# EAGLE schematic LIDAR_BreakoutV2 (EAGLE 9.2.0)
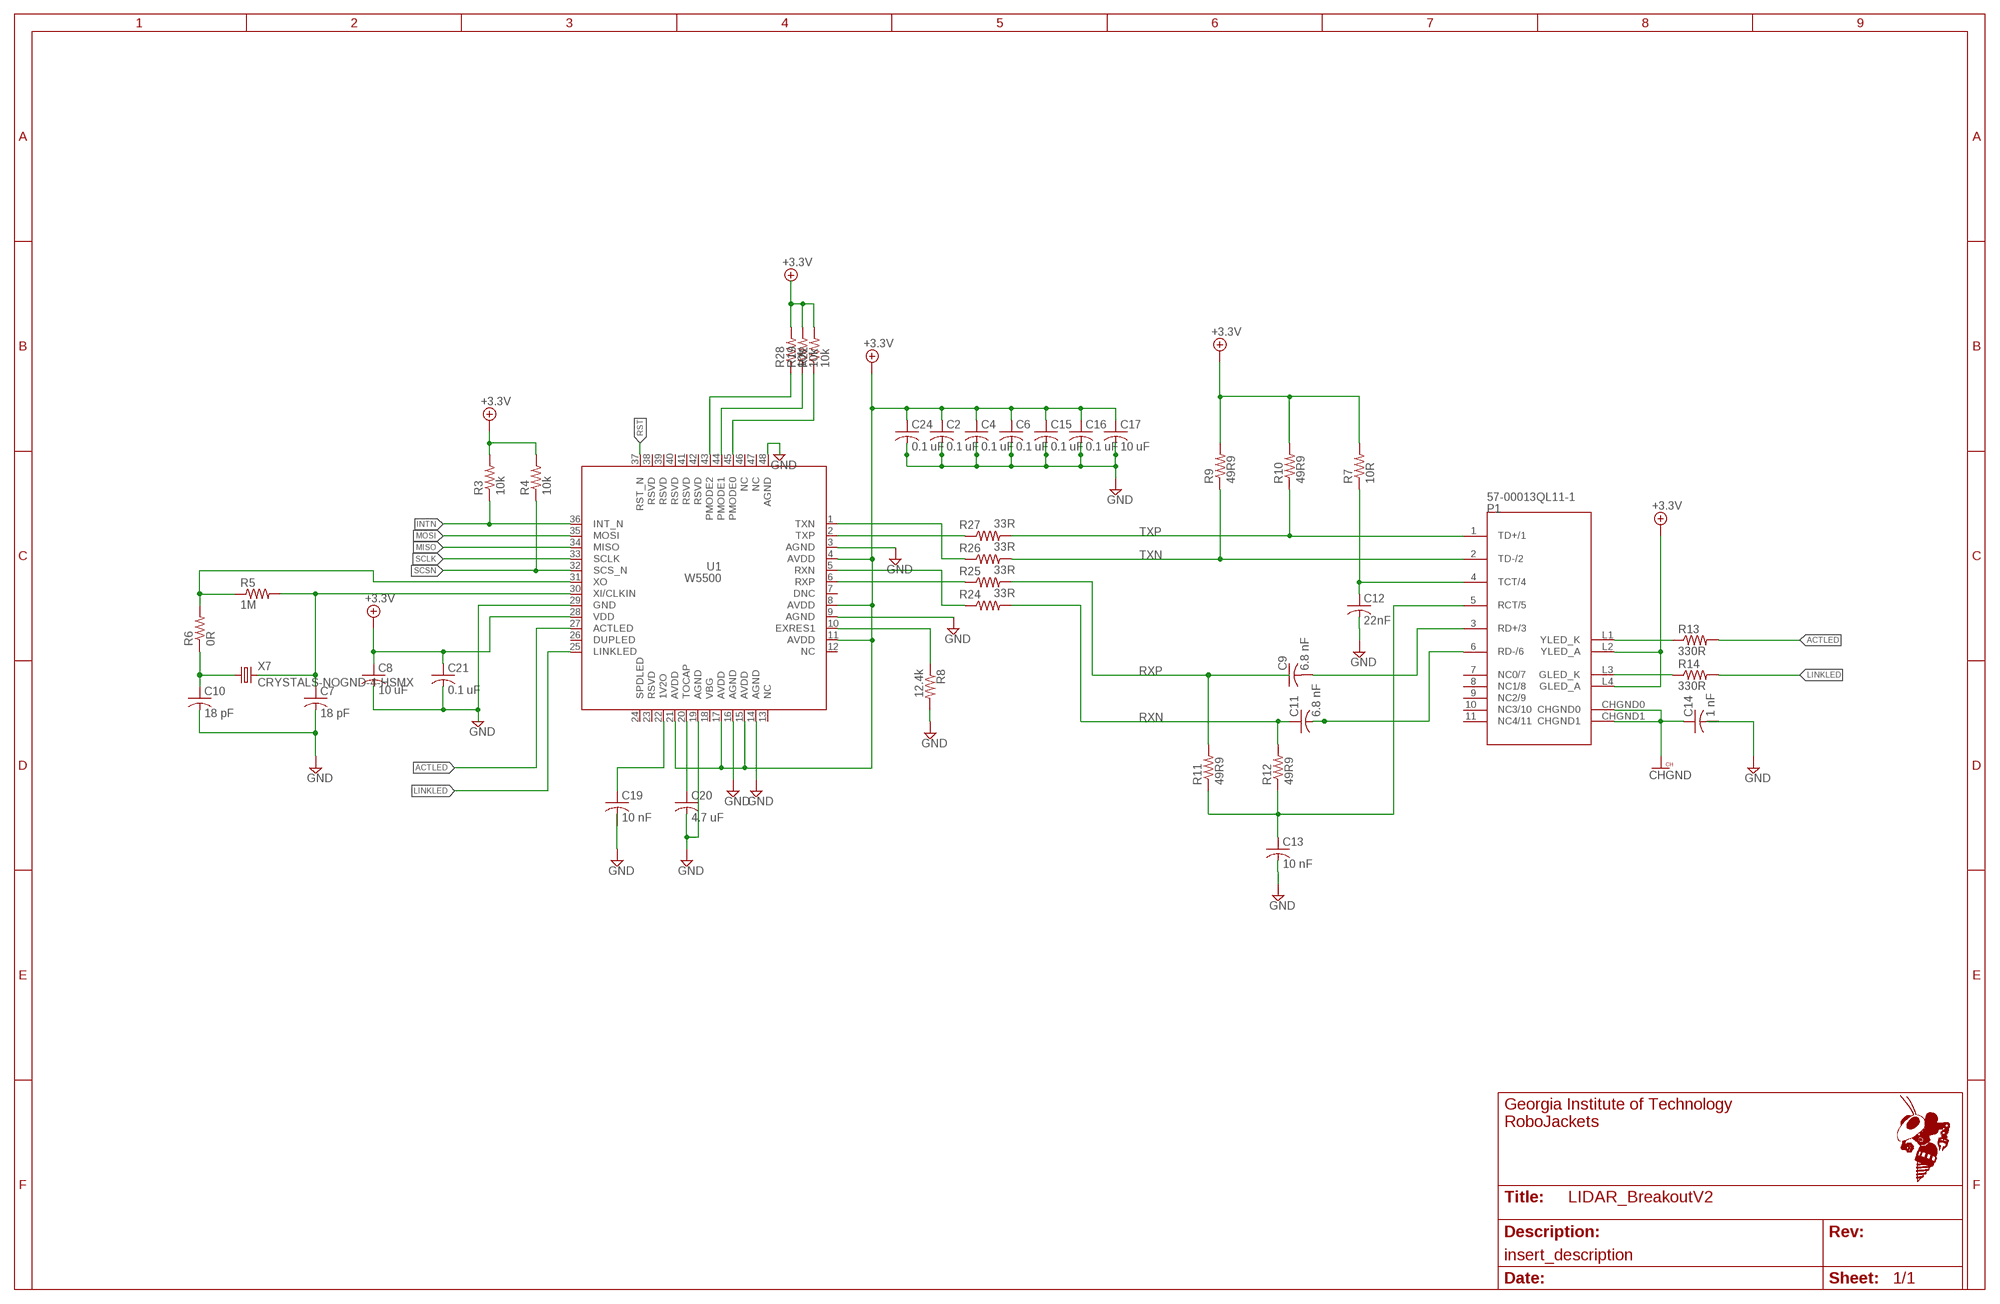
[diagram p0: schematic, sheet 1, part 1 of 2]
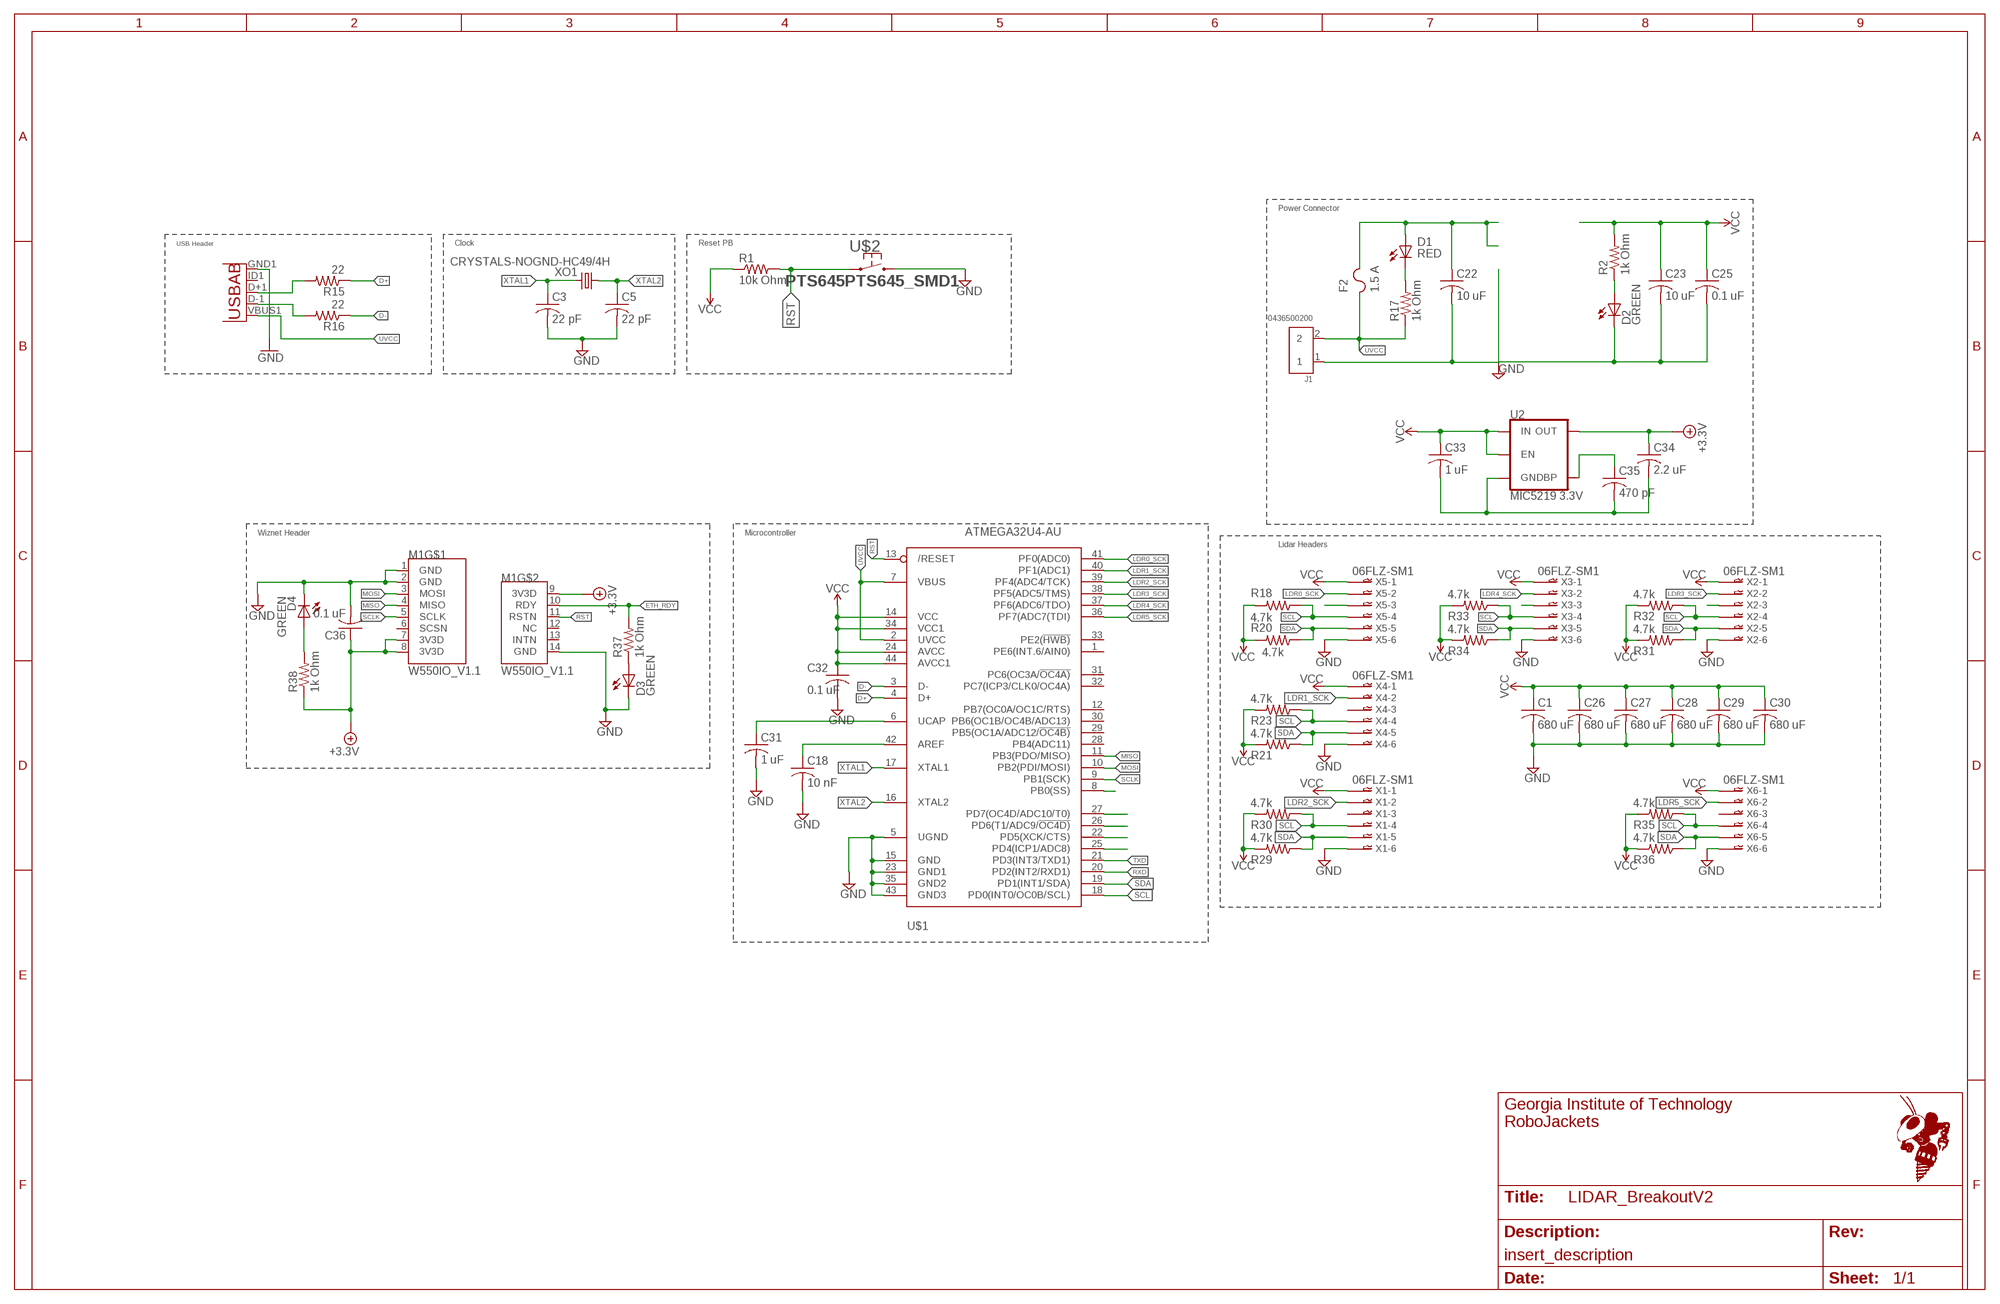
[diagram p1: schematic, sheet 1, part 2 of 2]
FRAME1 (FRAME_B_L): SCH_DESC: insert_description
FRAME2 (FRAME_B_L): SCH_DESC: insert_description

## Parts
C1  680 uF  C-USC3216  [C3216]
C2  0.1 uF  C-USC1608  [C1608]
C3  22 pF  C-USC0603  [C0603]
C4  0.1 uF  C-USC1608  [C1608]
C5  22 pF  C-USC0603  [C0603]
C6  0.1 uF  C-USC1608  [C1608]
C7  18 pF  C-USC1608  [C1608]
C8  10 uF  C-USC3216  [C3216]
C9  6.8 nF  C-USC1608  [C1608]
C10  18 pF  C-USC1608  [C1608]
C11  6.8 nF  C-USC1608  [C1608]
C12  22nF  C-USC1608  [C1608]
C13  10 nF  C-USC1608  [C1608]
C14  1 nF  C-USC1808  [C1808]
C15  0.1 uF  C-USC1608  [C1608]
C16  0.1 uF  C-USC1608  [C1608]
C17  10 uF  C-USC3216  [C3216]
C18  10 nF  C-USC0603  [C0603]
C19  10 nF  C-USC0603  [C0603]
C20  4.7 uF  C-USC0603  [C0603]
C21  0.1 uF  C-USC1608  [C1608]
C22  10 uF  C-USC3216  [C3216]
C23  10 uF  C-USC3216  [C3216]
C24  0.1 uF  C-USC1608  [C1608]
C25  0.1 uF  C-USC0603  [C0603]
C26  680 uF  C-USC3216  [C3216]
C27  680 uF  C-USC3216  [C3216]
C28  680 uF  C-USC3216  [C3216]
C29  680 uF  C-USC3216  [C3216]
C30  680 uF  C-USC3216  [C3216]
C31  1 uF  C-USC0603  [C0603]
C32  0.1 uF  C-USC0603  [C0603]
C33  1 uF  C-USC0603  [C0603]
C34  2.2 uF  C-USC0603  [C0603]
C35  470 pF  C-USC0603  [C0603]
C36  0.1 uF  C-USC0603  [C0603]
D1  RED  LED-SMD-RED  [CHIP-LED0603]
D2  GREEN  LEDCHIP-LED0603  [CHIP-LED0603]
D3  GREEN  LEDCHIP-LED0603  [CHIP-LED0603]
D4  GREEN  LEDCHIP-LED0603  [CHIP-LED0603]
F2  1.5 A  CHIP_FUSE0603  [F0603]
J1  0436500200  [MOLEX_0436500200]
M1  W550IO_V1.1  [WIZ550IO_V1.1]
P1  57-00013QL11-1  [57-00013QL11-1]
R1  10k Ohm  R-US_R0603  [R0603]
R2  1k Ohm  R-US_R0603  [R0603]
R3  10k  R-US_R0603  [R0603]
R4  10k  R-US_R0603  [R0603]
R5  1M  R-US_R0603  [R0603]
R6  0R  R-US_R0603  [R0603]
R7  10R  R-US_R0603  [R0603]
R8  12.4k  R-US_R0603  [R0603]
R9  49R9  R-US_R0603  [R0603]
R10  49R9  R-US_R0603  [R0603]
R11  49R9  R-US_R0603  [R0603]
R12  49R9  R-US_R0603  [R0603]
R13  330R  R-US_R0603  [R0603]
R14  330R  R-US_R0603  [R0603]
R15  22  RESISTOR0603-RES  [0603-RES]
R16  22  RESISTOR0603-RES  [0603-RES]
R17  1k Ohm  R-US_R0603  [R0603]
R18  4.7k  R-US_R0603  [R0603]
R19  10k  R-US_R0603  [R0603]
R20  4.7k  R-US_R0603  [R0603]
R21  4.7k  R-US_R0603  [R0603]
R22  10k  R-US_R0603  [R0603]
R23  4.7k  R-US_R0603  [R0603]
R24  33R  R-US_R0603  [R0603]
R25  33R  R-US_R0603  [R0603]
R26  33R  R-US_R0603  [R0603]
R27  33R  R-US_R0603  [R0603]
R28  10k  R-US_R0603  [R0603]
R29  4.7k  R-US_R0603  [R0603]
R30  4.7k  R-US_R0603  [R0603]
R31  4.7k  R-US_R0603  [R0603]
R32  4.7k  R-US_R0603  [R0603]
R33  4.7k  R-US_R0603  [R0603]
R34  4.7k  R-US_R0603  [R0603]
R35  4.7k  R-US_R0603  [R0603]
R36  4.7k  R-US_R0603  [R0603]
R37  1k Ohm  R-US_R0603  [R0603]
R38  1k Ohm  R-US_R0603  [R0603]
U1  W5500  [W5500]
U2  MIC5219 3.3V  V_REG_MIC52193.3V  [SOT23-5]
U$1  ATMEGA32U4-AU  [TQFP44]
U$2  PTS645PTS645_SMD1  [PTS645_SMD]
X1  06FLZ-SM1  [6FLZ-SM]
X2  06FLZ-SM1  [6FLZ-SM]
X3  06FLZ-SM1  [6FLZ-SM]
X4  06FLZ-SM1  [6FLZ-SM]
X5  06FLZ-SM1  [6FLZ-SM]
X6  06FLZ-SM1  [6FLZ-SM]
X7  CRYSTALS-NOGND-4-HSMX  [HC49-4-HSMX]
X8  USB-ABIN&OUT  [USB-AB-MICRO-SMD-V03-IN&OUT]
XO1  CRYSTALS-NOGND-HC49/4H  [HC49]

## Nets
+3.3V: C2.1 C4.1 C6.1 C8.1 C15.1 C16.1 C17.1 C21.1 C24.1 C34.1 C36.1 M1.7(3V3D) M1.8(3V3D) M1.9(3V3D) P1.L2(YLED_A) P1.L4(GLED_A) R3.2 R4.2 R7.2 R9.2 R10.2 R19.2 R22.2 R28.2 R38.1 U1.4(AVDD) U1.8(AVDD) U1.11(AVDD) U1.15(AVDD) U1.17(AVDD) U1.21(AVDD) U1.28(VDD) U2.5(OUT)
ACTLED: R13.2 U1.27(ACTLED)
CHGND: C14.1 P1.CHGND0 P1.CHGND1
D+: R15.1 U$1.4(D+)
D-: R16.1 U$1.3(D-)
ETH_RDY: M1.10(RDY) R37.2
GND: C1.2 C2.2 C3.2 C4.2 C5.2 C6.2 C7.2 C8.2 C10.2 C12.2 C13.2 C14.2 C15.2 C16.2 C17.2 C18.2 C19.2 C20.2 C21.2 C22.2 C23.2 C24.2 C25.2 C26.2 C27.2 C28.2 C29.2 C30.2 C31.2 C32.2 C36.2 D2.C D3.C D4.C J1.1 M1.1(GND) M1.2(GND) M1.14(GND) R8.2 U1.3(AGND) U1.9(AGND) U1.14(AGND) U1.16(AGND) U1.19(AGND) U1.29(GND) U1.48(AGND) U$1.5(UGND) U$1.15(GND) U$1.23(GND1) U$1.35(GND2) U$1.43(GND3) U$2.P$3 U$2.P$4 X1.6 X2.6 X3.6 X4.6 X5.6 X6.6 X8.GND1(GND)
INTN: R3.1 U1.36(INT_N)
LDR0_SCK: U$1.41(PF0(ADC0)) X5.2
LDR1_SCK: U$1.40(PF1(ADC1)) X4.2
LDR2_SCK: U$1.39(PF4(ADC4/TCK)) X1.2
LDR3_SCK: U$1.38(PF5(ADC5/TMS)) X2.2
LDR4_SCK: U$1.37(PF6(ADC6/TDO)) X3.2
LDR5_SCK: U$1.36(PF7(ADC7(TDI)) X6.2
LEFT_B: U$1.27(PD7(OC4D/ADC10/T0))
LIFT_A: U$1.26(PD6(T1/ADC9/!OC4D))
LINKLED: R14.2 U1.25(LINKLED)
MISO: M1.4(MISO) U1.34(MISO) U$1.11(PB3(PDO/MISO)) U$1.25(PD4(ICP1/ADC8))
MOSI: M1.3(MOSI) U1.35(MOSI) U$1.10(PB2(PDI/MOSI)) U$1.22(PD5(XCK/CTS)) X5.3
N$1: C10.1 R6.1 X7.1
N$2: C22.1 D1.A F2.2
N$3: D2.A R2.1
N$4: R28.1 U1.43(PMODE2)
N$6: D1.C(K) R17.2
N$7: C18.1 U$1.42(AREF)
N$8: X2.3
N$9: C31.1 U$1.6(UCAP)
N$10: R19.1 U1.44(PMODE1)
N$11: R22.1 U1.45(PMODE0)
N$12: X3.3
N$13: C20.1 U1.20(TOCAP)
N$14: R16.2 X8.D-1(D-)
N$15: C19.1 U1.22(1V2O)
N$16: C9.2 P1.3(RD+/3)
N$17: R8.1 U1.10(EXRES1)
N$18: C11.2 P1.6(RD-/6)
N$19: C13.1 P1.5(RCT/5) R11.1 R12.1
N$20: R25.1 U1.6(RXP)
N$21: C12.1 P1.4(TCT/4) R7.1
N$22: R5.1 R6.2 U1.31(XO)
N$23: R15.2 X8.D+1(D+)
N$24: P1.L3(GLED_K) R14.1
N$25: P1.L1(YLED_K) R13.1
N$26: R24.1 U1.5(RXN)
N$27: R27.1 U1.2(TXP)
N$28: R26.1 U1.1(TXN)
N$29: C7.1 R5.2 U1.30(XI/CLKIN) X7.2
N$30: D3.A R37.1
N$31: C35.1 U2.4(BP)
N$32: C33.2 C34.2 C35.2 U2.2(GND)
N$34: D4.A R38.2
RST: M1.11(RSTN) R1.2 U1.37(RST_N) U$1.13(/RESET) U$2.P$1 U$2.P$2
RXD: U$1.20(PD2(INT2/RXD1))
RXN: C11.1 R12.2 R24.2
RXP: C9.1 R11.2 R25.2
SCL: R18.1 R23.1 R30.1 R32.1 R33.1 R35.1 U$1.18(PD0(INT0/OC0B/SCL)) X1.4 X2.4 X3.4 X4.4 X5.4 X6.4
SCLK: M1.5(SCLK) U1.33(SCLK) U$1.9(PB1(SCK))
SCSN: R4.1 U1.32(SCS_N) U$1.8(PB0(SS))
SDA: R20.1 R21.1 R29.1 R31.1 R34.1 R36.1 U$1.19(PD1(INT1/SDA)) X1.5 X2.5 X3.5 X4.5 X5.5 X6.5
TXD: U$1.21(PD3(INT3/TXD1))
TXN: P1.2(TD-/2) R9.1 R26.2
TXP: P1.1(TD+/1) R10.1 R27.2
UVCC: F2.1 J1.2 R17.1 U$1.2(UVCC) U$1.7(VBUS) X8.VBUS1(VBUS)
VCC: C1.1 C23.1 C25.1 C26.1 C27.1 C28.1 C29.1 C30.1 C32.1 C33.1 R1.1 R2.2 R18.2 R20.2 R21.2 R23.2 R29.2 R30.2 R31.2 R32.2 R33.2 R34.2 R35.2 R36.2 U2.1(IN) U2.3(EN) U$1.14(VCC) U$1.24(AVCC) U$1.34(VCC1) U$1.44(AVCC1) X1.1 X2.1 X3.1 X4.1 X5.1 X6.1
XTAL1: C3.1 U$1.17(XTAL1) XO1.2
XTAL2: C5.1 U$1.16(XTAL2) XO1.1
Unconnected: M1.6(SCSN) M1.12(NC) M1.13(INTN) P1.7(NC0/7) P1.8(NC1/8) P1.9(NC2/9) P1.10(NC3/10) P1.11(NC4/11) U1.7(DNC) U1.12(NC) U1.13(NC) U1.18(VBG) U1.23(RSVD) U1.24(SPDLED) U1.26(DUPLED) U1.38(RSVD) U1.39(RSVD) U1.40(RSVD) U1.41(RSVD) U1.42(RSVD) U1.46(NC) U1.47(NC) U$1.1(PE6(INT.6/AIN0)) U$1.12(PB7(OC0A/OC1C/RTS)) U$1.28(PB4(ADC11)) U$1.29(PB5(OC1A/ADC12/!OC4B)) U$1.30(PB6(OC1B/OC4B/ADC13)) U$1.31(PC6(OC3A/!OC4A)) U$1.32(PC7(ICP3/CLK0/OC4A)) U$1.33(PE2(!HWB)) X1.3 X4.3 X6.3 X8.ID1(USBID)

## Notes on the sheet
- Power Connector
- USB Header | Clock | Reset PB
- Wiznet Header | Microcontroller
- Lidar Headers

## Library data of the parts
C1 C2 C4 C6-C17 C21-C24 C26-C30 = rcl:C-US: CAPACITOR, American symbol; SPICEPREFIX: C
C3 C5 C18-C20 C25 C31-C36 = resistor:C-US: CAPACITOR, American symbol
D1 = RoboJackets-LEDs:LED-SMD; DIGIKEY: 160-1447-1-ND; MPN: LTST-C191KRKT
D2-D4 = led:LED: LED OSRAM: - CHIPLED LG R971, LG N971, LY N971, LG Q971, LY Q971, LO R971, LY R971 LH N974, LH R974 LS Q976, LO Q976, LY Q976 LO Q996 - Hyper CHIPLED LW Q18S LB Q993, LB Q99A, LB R99A - SideLED LS A670, LO A670, LY A670, LG A670, LP A670 LB A673, LV A673, LT A673, LW A673 LH A674 LY A675 LS A676, LA A676, LO A676, LY A676, LW A676 LS A679, LY A679, LG A679 - Hyper Micro SIDELED® LS Y876, LA Y876, LO Y876, LY Y876 LT Y87S - SmartLED LW L88C, LW L88S LB L89C, LB L89S, LG L890 LS L89K, LO L89K, LY L89K LS L896, LA L896, LO L896, LY L896 - TOPLED LS T670, LO T670, LY T670, LG T670, LP T670 LSG T670, LSP T670, LSY T670, LOP T670, LYG T670 LG T671, LOG T671, LSG T671 LB T673, LV T673, LT T673, LW T673 LH T674 LS T676, LA T676, LO T676, LY T676, LB T676, LH T676, LSB T676, LW T676 LB T67C, LV T67C, LT T67C, LS T67K, LO T67K, LY T67K, LW E67C LS E67B, LA E67B, LO E67B, LY E67B, LB E67C, LV E67C, LT E67C LW T67C LS T679, LY T679, LG T679 LS T770, LO T770, LY T770, LG T770, LP T770 LB T773, LV T773, LT T773, LW T773 LH T774 LS E675, LA E675, LY E675, LS T675 LS T776, LA T776, LO T776, LY T776, LB T776 LHGB T686 LT T68C, LB T68C - Hyper Mini TOPLED® LB M676 - Mini TOPLED Santana® LG M470 LS M47K, LO M47K, LY M47K Source: http://www.osram.convergy.de LUXEON: - LUMILED® LXK2-PW12-R00, LXK2-PW12-S00, LXK2-PW14-U00, LXK2-PW14-V00 LXK2-PM12-R00, LXK2-PM12-S00, LXK2-PM14-U00 LXK2-PE12-Q00, LXK2-PE12-R00, LXK2-PE12-S00, LXK2-PE14-T00, LXK2-PE14-U00 LXK2-PB12-K00, LXK2-PB12-L00, LXK2-PB12-M00, LXK2-PB14-N00, LXK2-PB14-P00, LXK2-PB14-Q00 LXK2-PR12-L00, LXK2-PR12-M00, LXK2-PR14-Q00, LXK2-PR14-R00 LXK2-PD12-Q00, LXK2-PD12-R00, LXK2-PD12-S00 LXK2-PH12-R00, LXK2-PH12-S00 LXK2-PL12-P00, LXK2-PL12-Q00, LXK2-PL12-R00 Source: www.luxeon.com KINGBRIGHT: KA-3528ASYC Source: www.kingbright.com
F2 = RoboJackets-Fuses:CHIP_FUSE
J1 = 0436500200:0436500200: CONN HEADER 2POS 3MM RT ANG TIN; DESCRIPTION: Conn Power HDR 2 POS 3mm Solder RA Thru-Hole 2 Terminal 1 Port Micro-Fit 3.0Ã¢âÂ¢ Tray; MF: Molex, LLC; MP: 0436500200; PACKAGE: None
M1 = WIZ550io_V1.1:W550IO_V1.1
P1 = 57-00013QL11-1:57-00013QL11-1
R1-R14 R17-R38 = rcl:R-US_: RESISTOR, American symbol; SPICEPREFIX: R
R15 R16 = SparkFun:RESISTOR: Resistor Basic schematic elements and footprints for 0603, 1206, and PTH resistors.
U1 = W5500:W5500
U2 = SparkFun-IC-Power:V_REG_MIC5219: V_REG MIC5219 Standard 3.3V and 5V 500mA LDO voltage regulator in SOT-23 layout. Micrel part MIC5219. BP (by-pass) pin is used to lower output noise with 470pF cap, may be left open.; PROD_ID: VREG-09872
U$1 = adafruit:ATMEGA32U4: http://www.ladyada.net/library/eagle
U$2 = RoboJackets-Switches:PTS645: Tactile Momentary Pushbutton with thru-hole legs. https://www.ckswitches.com/media/1471/pts645.pdf
X1-X6 = con-jst:06FLZ-SM1: CONNECTOR; OC_FARNELL: unknown; OC_NEWARK: unknown
X7 XO1 = IQD-Frequency-Products:CRYSTALS-NOGND: CRYSTALS CAN NOT GROUNDED
X8 = Testing:USB-AB: This is a USB AB connector that is compatible with USB OTG. i.e. this connector can serve as a host or device

## Net classes
0 default: width 0.203 mm